# Altium schematic sheet wire_cutter_sch.SchDoc
size A4; Author: Hoang; Organization: Altium Limited; Address1: L3, 12a Rodborough Rd; Address2: Frenchs Forest; Address3: NSW; Address4: Australia 2086; SheetNumber: 1; SheetTotal: 1
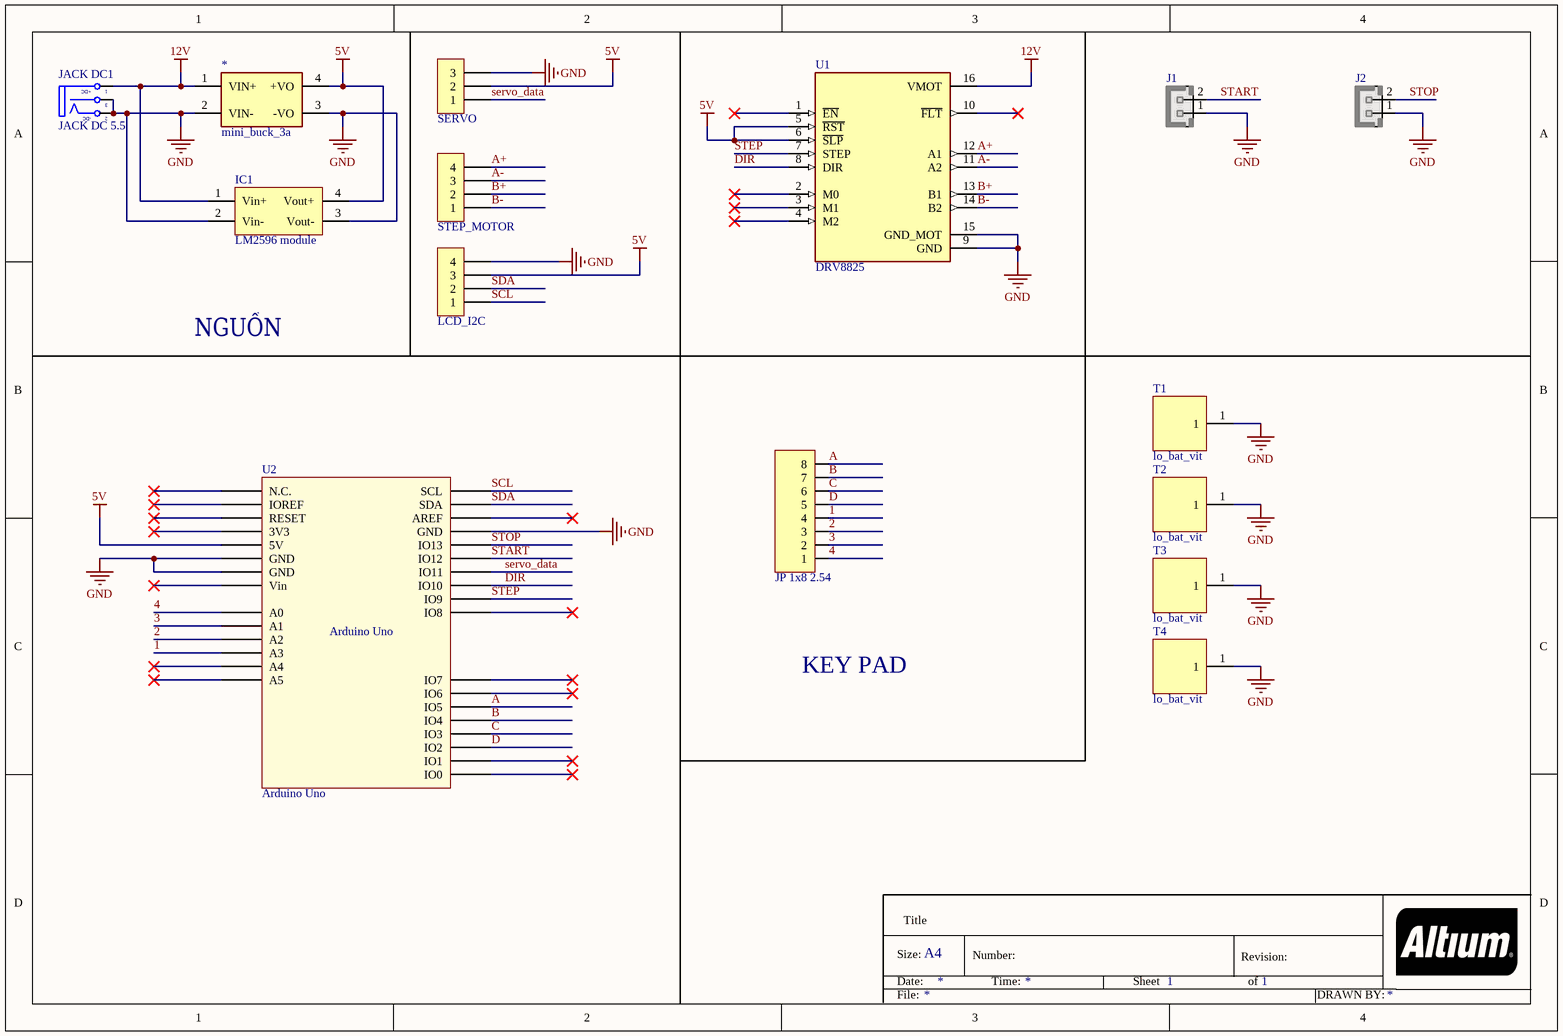
[diagram p0: wire_cutter_sch.SchDoc]

## Parts
*  mini_buck_3a  [MINI_BUCK_3A]
H1  SERVO  [Header 3P DC 2.54]
H2  STEP_MOTOR  [Header 4P DC 2.54]
H3  LCD_I2C  [Header 4P DC 2.54]
IC1  LM2596 module  [LM2596 Module]
J1  HHDR_2  [XH_2]  (value not drawn)
J2  HHDR_2  [XH_2]  (value not drawn)
JACK_DC1  JACK DC 5.5  [JACK DC 5.5]
JP1  JP 1x8 2.54  [JP 1x8 DT]
T1  lo_bat_vit  [lo_bat_vit]
T2  lo_bat_vit  [lo_bat_vit]
T3  lo_bat_vit  [lo_bat_vit]
T4  lo_bat_vit  [lo_bat_vit]
U1  DRV8825  [DRV8825]
U2  Arduino Uno  [Arduino Uno]

## Nets
5V: *.4(+VO) H1.2 H3.3 IC1.4(Vout+) U1.5(~{RST}) U1.6(~{SLP}) U2.5V
12V: *.1(VIN+) IC1.1(Vin+) JACK_DC1.1(T) U1.16(VMOT)
GND: *.2(VIN-) *.3(-VO) H1.3 H3.4 IC1.2(Vin-) IC1.3(Vout-) J1.1 J2.1 JACK_DC1.2(TN) JACK_DC1.3(S) T1.1 T2.1 T3.1 T4.1 U1.9(GND) U1.15(GND_MOT) U2.GND1(GND) U2.GND2(GND) U2.GND3(GND)
1: JP1.4 U2.A3
2: JP1.3 U2.A2
3: JP1.2 U2.A1
4: JP1.1 U2.A0
\: J1.2 U2.12(IO12)  [also labelled START]
A: JP1.8 U2.5(IO5)
A+: H2.4 U1.12(A1)
A-: H2.3 U1.11(A2)
B: JP1.7 U2.4(IO4)
B+: H2.2 U1.13(B1)
B-: H2.1 U1.14(B2)
C: JP1.6 U2.3(IO3)
D: JP1.5 U2.2(IO2)
DIR: U1.8(DIR) U2.10(IO10)
SCL: H3.1 U2.SCL
SDA: H3.2 U2.SDA
servo_data: H1.1 U2.11(IO11)
STEP: U1.7(STEP) U2.9(IO9)
STOP: J2.2 U2.13(IO13)

Not connected (* = marked no-connect by the designer): U1 1(~{EN})* 2(M0)* 3(M1)* 4(M2)* 10(~{FLT})*; U2 0(IO0)* 1(IO1)* 3V3* 6(IO6)* 7(IO7)* 8(IO8)* A4* A5* AREF* IOREF* NC(N.C.)* RESET* Vin*

## Notes on the sheet
- NGUỒN
- KEY PAD
- Title
- Size:
- Date:
- A4
- Number:
- Time:
- Sheet
- Revision:
- of
- File:
- DRAWN BY:
- (in symbol JACK DC 5.5) +DC; -DC

## Library data of the parts
H1 = Header 3P 2.54 Duc Cong: Cắm; Ten_Linh_Kien: Header 3P XH2.54-3P Đực Cong; Don_Vi: Con; Ma_Hang: MH001302; Chung_Loai: Cắm
H2 H3 = Header 4P 2.54 Duc Cong: Cắm; Ten_Linh_Kien: Header 4P XH2.54-4P Đực Cong; Don_Vi: Con; Ma_Hang: MH001310; Chung_Loai: Cắm
J1 J2 = XH_2: JST-XH pitch: 2.5mm; VALUE: HHDR_2
JACK_DC1 = JACK DC 5.5: Value: Jac DC
JP1 = JP 1x8 2.54 Duc Thang: Cắm; Ten_Linh_Kien: Jump Đơn Đực 2.54MM 1x40P Thẳng 11MM; Don_Vi: Con; Ma_Hang: MH000903; Ghi_Chu: *; Kieu_Chan: *; Chung_Loai: Cắm